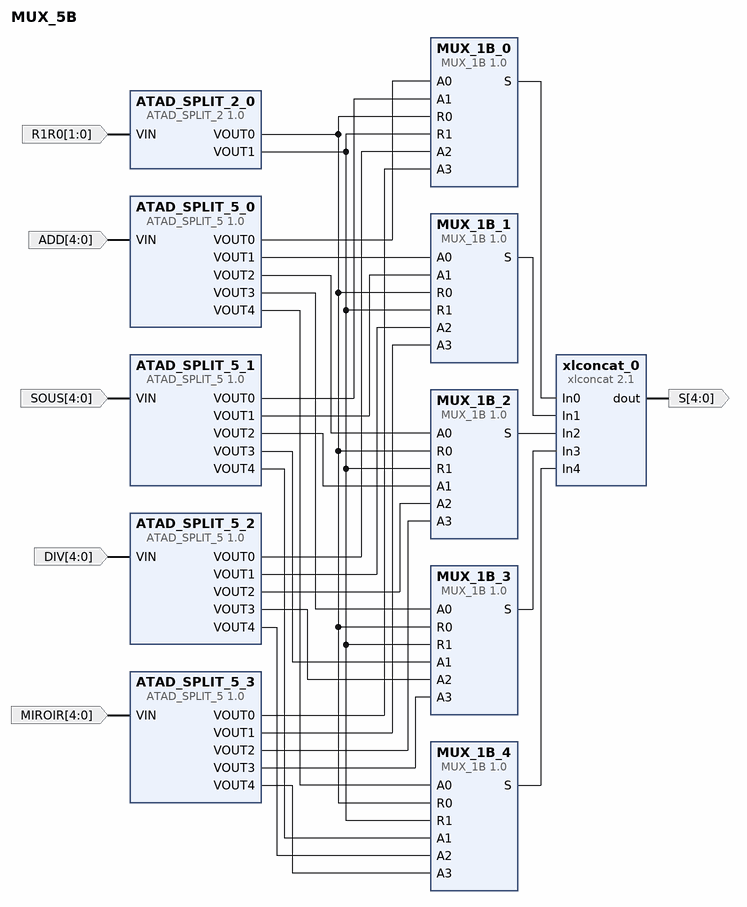
[diagram p0: block diagram of the top level]
# Vivado block design MUX_5B, xc7a100tcsg324-1, Vivado 2019.1
create_bd_design MUX_5B

create_bd_port -dir I -from 4 -to 0 ADD
create_bd_port -dir I -from 4 -to 0 SOUS
create_bd_port -dir I -from 4 -to 0 DIV
create_bd_port -dir I -from 4 -to 0 MIROIR
create_bd_port -dir I -from 1 -to 0 R1R0
create_bd_port -dir O -from 4 -to 0 S

create_bd_cell -type ip -vlnv xilinx.com:user:MUX_1B:1.0 MUX_1B_0
create_bd_cell -type ip -vlnv xilinx.com:user:MUX_1B:1.0 MUX_1B_1
create_bd_cell -type ip -vlnv xilinx.com:user:MUX_1B:1.0 MUX_1B_2
create_bd_cell -type ip -vlnv xilinx.com:user:MUX_1B:1.0 MUX_1B_3
create_bd_cell -type ip -vlnv xilinx.com:ip:xlconcat:2.1 xlconcat_0
set_property -dict {CONFIG.NUM_PORTS 5} [get_bd_cells xlconcat_0]
create_bd_cell -type ip -vlnv xilinx.com:user:ATAD_SPLIT_5:1.0 ATAD_SPLIT_5_0
create_bd_cell -type ip -vlnv xilinx.com:user:ATAD_SPLIT_5:1.0 ATAD_SPLIT_5_1
create_bd_cell -type ip -vlnv xilinx.com:user:ATAD_SPLIT_5:1.0 ATAD_SPLIT_5_2
create_bd_cell -type ip -vlnv xilinx.com:user:ATAD_SPLIT_5:1.0 ATAD_SPLIT_5_3
create_bd_cell -type ip -vlnv xilinx.com:user:MUX_1B:1.0 MUX_1B_4
create_bd_cell -type ip -vlnv xilinx.com:user:ATAD_SPLIT_2:1.0 ATAD_SPLIT_2_0

# ---- connections ----

connect_bd_net [get_bd_ports ADD] [get_bd_pins ATAD_SPLIT_5_0/VIN]
connect_bd_net [get_bd_ports SOUS] [get_bd_pins ATAD_SPLIT_5_1/VIN]
connect_bd_net [get_bd_ports DIV] [get_bd_pins ATAD_SPLIT_5_2/VIN]
connect_bd_net [get_bd_ports MIROIR] [get_bd_pins ATAD_SPLIT_5_3/VIN]
connect_bd_net [get_bd_pins ATAD_SPLIT_5_0/VOUT0] [get_bd_pins MUX_1B_0/A0]
connect_bd_net [get_bd_pins ATAD_SPLIT_5_0/VOUT1] [get_bd_pins MUX_1B_1/A0]
connect_bd_net [get_bd_pins ATAD_SPLIT_5_0/VOUT2] [get_bd_pins MUX_1B_2/A0]
connect_bd_net [get_bd_pins ATAD_SPLIT_5_0/VOUT3] [get_bd_pins MUX_1B_3/A0]
connect_bd_net [get_bd_pins ATAD_SPLIT_5_0/VOUT4] [get_bd_pins MUX_1B_4/A0]
connect_bd_net [get_bd_pins ATAD_SPLIT_5_1/VOUT0] [get_bd_pins MUX_1B_0/A1]
connect_bd_net [get_bd_pins ATAD_SPLIT_5_1/VOUT1] [get_bd_pins MUX_1B_1/A1]
connect_bd_net [get_bd_pins ATAD_SPLIT_5_1/VOUT3] [get_bd_pins MUX_1B_3/A1]
connect_bd_net [get_bd_pins ATAD_SPLIT_5_1/VOUT4] [get_bd_pins MUX_1B_4/A1]
connect_bd_net [get_bd_pins ATAD_SPLIT_5_2/VOUT0] [get_bd_pins MUX_1B_0/A2]
connect_bd_net [get_bd_pins ATAD_SPLIT_5_2/VOUT1] [get_bd_pins MUX_1B_1/A2]
connect_bd_net [get_bd_pins ATAD_SPLIT_5_2/VOUT2] [get_bd_pins MUX_1B_2/A2]
connect_bd_net [get_bd_pins ATAD_SPLIT_5_2/VOUT3] [get_bd_pins MUX_1B_3/A2]
connect_bd_net [get_bd_pins ATAD_SPLIT_5_2/VOUT4] [get_bd_pins MUX_1B_4/A2]
connect_bd_net [get_bd_pins ATAD_SPLIT_5_3/VOUT0] [get_bd_pins MUX_1B_0/A3]
connect_bd_net [get_bd_pins ATAD_SPLIT_5_3/VOUT1] [get_bd_pins MUX_1B_1/A3]
connect_bd_net [get_bd_pins ATAD_SPLIT_5_3/VOUT2] [get_bd_pins MUX_1B_2/A3]
connect_bd_net [get_bd_pins ATAD_SPLIT_5_3/VOUT3] [get_bd_pins MUX_1B_3/A3]
connect_bd_net [get_bd_pins ATAD_SPLIT_5_3/VOUT4] [get_bd_pins MUX_1B_4/A3]
connect_bd_net [get_bd_pins xlconcat_0/dout] [get_bd_ports S]
connect_bd_net [get_bd_pins MUX_1B_0/S] [get_bd_pins xlconcat_0/In0]
connect_bd_net [get_bd_pins MUX_1B_1/S] [get_bd_pins xlconcat_0/In1]
connect_bd_net [get_bd_pins MUX_1B_2/S] [get_bd_pins xlconcat_0/In2]
connect_bd_net [get_bd_pins MUX_1B_3/S] [get_bd_pins xlconcat_0/In3]
connect_bd_net [get_bd_pins MUX_1B_4/S] [get_bd_pins xlconcat_0/In4]
connect_bd_net -net R1R0_1 [get_bd_ports R1R0] [get_bd_pins ATAD_SPLIT_2_0/VIN]
connect_bd_net [get_bd_pins ATAD_SPLIT_2_0/VOUT0] \
  [get_bd_pins MUX_1B_0/R0] [get_bd_pins MUX_1B_1/R0] [get_bd_pins MUX_1B_2/R0] [get_bd_pins MUX_1B_3/R0] \
  [get_bd_pins MUX_1B_4/R0]
connect_bd_net [get_bd_pins ATAD_SPLIT_2_0/VOUT1] \
  [get_bd_pins MUX_1B_0/R1] [get_bd_pins MUX_1B_1/R1] [get_bd_pins MUX_1B_3/R1] [get_bd_pins MUX_1B_2/R1] \
  [get_bd_pins MUX_1B_4/R1]
connect_bd_net [get_bd_pins ATAD_SPLIT_5_1/VOUT2] [get_bd_pins MUX_1B_2/A1]

validate_bd_design
save_bd_design
